# EAGLE design delay (EAGLE 9.4.2)
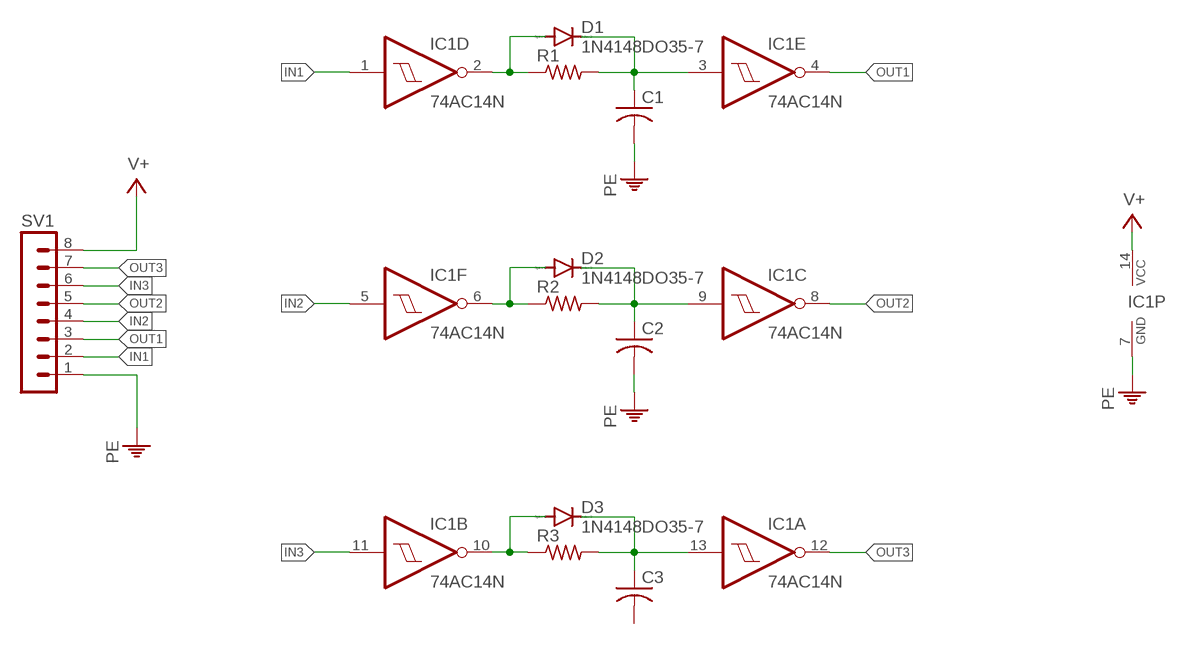
[diagram p0: schematic, sheet 1]

## Parts
C1  C-US025-025X050  [C025-025X050]
C2  C-US025-025X050  [C025-025X050]
C3  C-US025-025X050  [C025-025X050]
D1  1N4148DO35-7  [DO35-7]
D2  1N4148DO35-7  [DO35-7]
D3  1N4148DO35-7  [DO35-7]
IC1  74AC14N  [DIL14]
R1  R-US_0204/7  [0204/7]
R2  R-US_0204/7  [0204/7]
R3  R-US_0204/7  [0204/7]
SV1  MA08-1  [MA08-1]

## Nets
IN1: IC1.1(D:I) SV1.2
IN2: IC1.5(F:I) SV1.4
IN3: IC1.11(B:I) SV1.6
N$1: C1.1 D1.C IC1.3(E:I) R1.2
N$2: D1.A IC1.2(D:O) R1.1
N$3: C2.1 D2.C IC1.9(C:I) R2.2
N$6: D2.A IC1.6(F:O) R2.1
N$7: C3.1 D3.C IC1.13(A:I) R3.2
N$8: D3.A IC1.10(B:O) R3.1
OUT1: IC1.4(E:O) SV1.3
OUT2: IC1.8(C:O) SV1.5
OUT3: IC1.12(A:O) SV1.7
PE: C1.2 C2.2 IC1.7(P:GND) SV1.1
V+: IC1.14(P:VCC) SV1.8
Unconnected: C3.2

## Library data of the parts
C1-C3 = rcl:C-US: CAPACITOR, American symbol; SPICEPREFIX: C
D1-D3 = diode:1N4148: DIODE high speed (Philips)
IC1 = 74xx-eu:74*14: Hex schmitt trigger INVERTER
R1-R3 = rcl:R-US_: RESISTOR, American symbol; SPICEPREFIX: R
SV1 = con-lstb:MA08-1: PIN HEADER; OC_FARNELL: unknown; OC_NEWARK: unknown

## Board
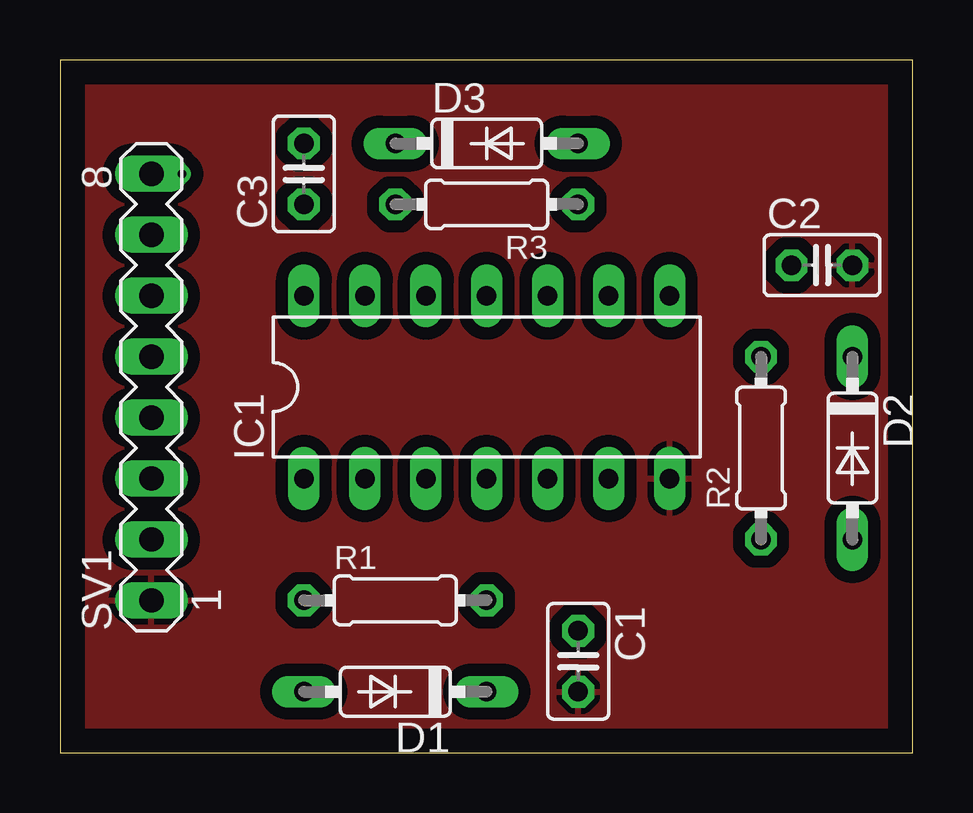
[diagram p1: board, top side]
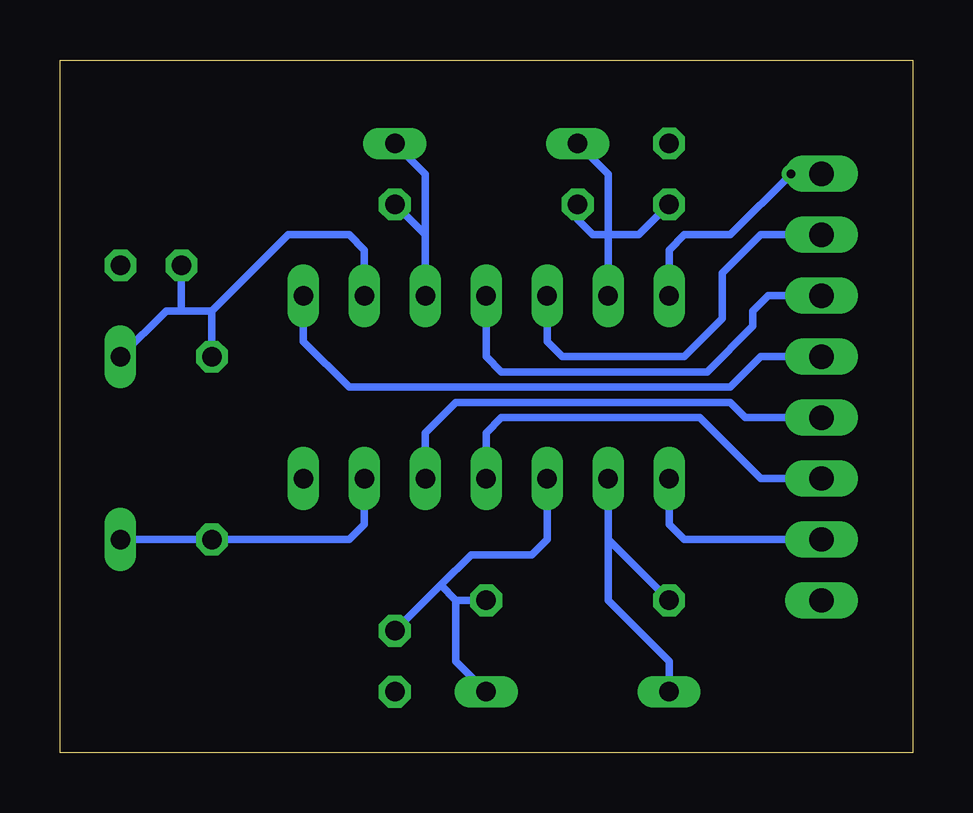
[diagram p2: board, bottom side, seen from below]

Size 35.54 x 28.88 mm. Coordinates in mm from the lower left corner, seen from the top.
Outline: 0,0 35.54,0 35.54,28.88 0,28.88 0,0
Copper layers (1*16): Top 0.035mm / dielectric 1.5mm / Bottom 0.035mm
Design rules "default": minimum track width 6mil, minimum drill 0.35mm, track to track 6mil, track to pad 6mil, pad to pad 6mil, via to via 6mil, smd to smd 6mil, copper to edge 40mil, drill to drill 6mil, minimum pad ring 10mil, minimum via ring 8mil, stop-mask expansion 4mil, vias tented up to drill 0mil, thermal gap 10mil

### Footprints (pad centres in the part's own frame; a part is rotated, then mirrored left to right if it is on the bottom)
C025-025X050 = drill 0.813 octagon: 1 -1.27,0; 2 1.27,0
DO35-7 = drill 0.813 long: A 3.81,0; C -3.81,0
DIL14 = drill 0.813 long: 1 -7.62,-3.81; 2 -5.08,-3.81; 3 -2.54,-3.81; 4 0,-3.81; 5 2.54,-3.81; 6 5.08,-3.81; 7 7.62,-3.81; 8 7.62,3.81; 9 5.08,3.81; 10 2.54,3.81; 11 0,3.81; 12 -2.54,3.81; 13 -5.08,3.81; 14 -7.62,3.81
0204/7 = drill 0.813 octagon: 1 -3.81,0; 2 3.81,0
MA08-1 = drill 1.016 long: 1 -8.89,0; 2 -6.35,0; 3 -3.81,0; 4 -1.27,0; 5 1.27,0; 6 3.81,0; 7 6.35,0; 8 8.89,0

### Placement (x,y rotation side)
C1  21.59,3.81 270 top
C2  31.75,20.32 0 top
C3  10.16,24.13 90 top
D1  13.97,2.54 180 top
D2  33.02,12.7 270 top
D3  17.78,25.4 0 top
IC1  17.78,15.24 0 top
R1  13.97,6.35 0 top
R2  29.21,12.7 90 top
R3  17.78,22.86 180 top
SV1  3.81,15.24 90 top

### Tracks (layer width: path | path; a pad name or v marks a point on that pad's centre or on a via)
IN1
  Bottom 0.305: IC1.1 10.16,9.53 9.53,8.89 SV1.2
IN2
  Bottom 0.305: SV1.4 6.99,13.97 7.62,14.61 19.05,14.61 20.32,13.34 IC1.5
IN3
  Bottom 0.305: IC1.11 17.78,16.51 17.14,15.88 8.57,15.88 6.67,17.78 6.67,18.41 6.03,19.05 SV1.6
N$1
  Bottom 0.305: 19.68,6.99 18.41,8.26 15.88,8.26 15.24,8.89 IC1.3 | 19.68,6.99 C1.1 | R1.2 19.05,6.35 | 19.05,6.35 19.68,6.99 | 19.05,6.35 19.05,3.81 D1.C
N$2
  Bottom 0.305: D1.A 10.16,3.81 12.7,6.35 12.7,8.89 | IC1.2 12.7,8.89 | 12.7,8.89 R1.1
N$3
  Bottom 0.305: C2.1 30.48,18.41 | D2.C 31.11,18.41 30.48,18.41 | IC1.9 22.86,20.95 23.5,21.59 26.04,21.59 29.21,18.41 | 29.21,18.41 30.48,18.41 | R2.2 29.21,18.41
N$6
  Bottom 0.305: D2.A R2.1 23.5,8.89 22.86,9.53 IC1.6
N$7
  Bottom 0.305: IC1.13 12.7,21.59 | 12.7,21.59 12.7,24.13 D3.C | R3.2 13.97,22.23 13.34,21.59 12.7,21.59 | C3.1 11.43,21.59 12.7,21.59
N$8
  Bottom 0.305: IC1.10 20.32,21.59 | 20.32,21.59 R3.1 | 20.32,21.59 20.32,24.13 D3.A
OUT1
  Bottom 0.305: IC1.4 17.78,13.34 17.14,13.97 8.89,13.97 6.35,11.43 SV1.3
OUT2
  Bottom 0.305: SV1.5 6.35,16.51 7.62,15.24 23.5,15.24 25.4,17.14 IC1.8
OUT3
  Bottom 0.305: SV1.7 6.35,21.59 7.94,20 7.94,18.1 9.53,16.51 14.61,16.51 15.24,17.14 IC1.12
PE
  pour Top (isolate 0.508): -1.27,30.48 36.83,30.48 36.83,-2.54 -1.27,-2.54
V+  (via drill 0.35)
  Top 0.152: SV1.8 v5.08,24.13
  Bottom 0.305: v5.08,24.13 7.62,21.59 9.53,21.59 10.16,20.95 IC1.14